# Altium schematic sheet joint_board_hall_effect_encoder.SchDoc
size A; DocumentNumber: 3
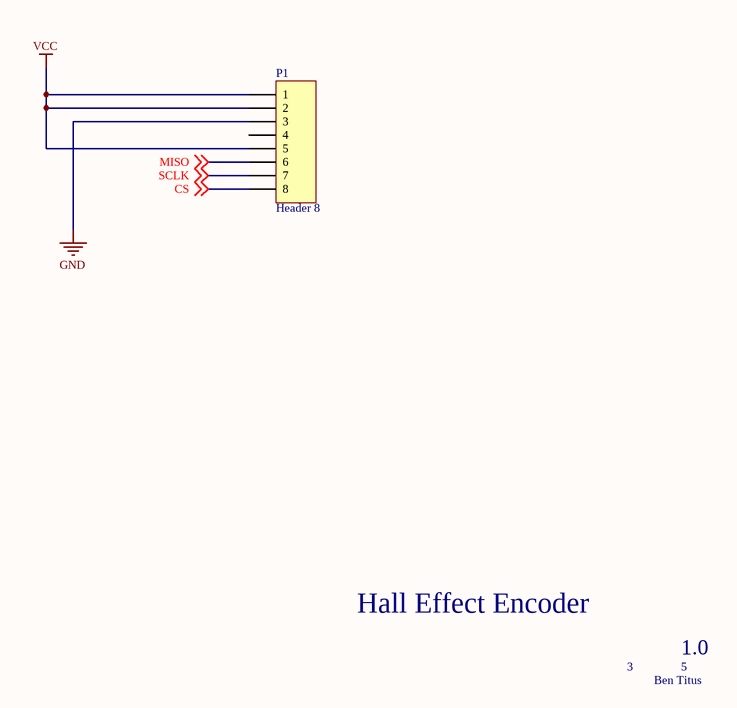
[diagram p0: joint_board_hall_effect_encoder.SchDoc]

## Parts
P1  Header 8  [HDR1X8]

## Nets
GND: P1.3
VCC: P1.1 P1.2 P1.5
CS: P1.8 ; off-sheet CS
MISO: P1.6 ; off-sheet MISO
SCLK: P1.7 ; off-sheet SCLK

Not connected (* = marked no-connect by the designer): P1 4

## Notes on the sheet
- Hall Effect Encoder
- 3
- 1.0
- 5
- Ben Titus

## Library data of the parts
P1 = Header 8: Header, 8-Pin; LatestRevisionDate: 17-Jul-2002; LatestRevisionNote: Re-released for DXP Platform.; Publisher: Altium Limited